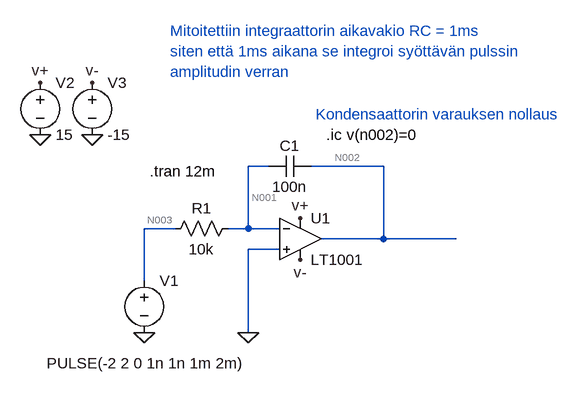
[diagram p0: schematic integraattori.asc]
integraattori.asc, the LTspice schematic file:
Version 4
SHEET 1 880 680
WIRE 336 -16 304 -16
WIRE 512 -16 400 -16
WIRE 192 80 144 80
WIRE 304 80 304 -16
WIRE 304 80 272 80
WIRE 352 80 304 80
WIRE 512 96 512 -16
WIRE 512 96 416 96
WIRE 624 96 512 96
WIRE 352 112 304 112
WIRE 144 160 144 80
WIRE 304 240 304 112
FLAG -16 -64 0
FLAG 64 -64 0
FLAG 144 240 0
FLAG 304 240 0
FLAG 384 64 v+
FLAG -16 -144 v+
FLAG 64 -144 v-
FLAG 384 128 v-
SYMBOL voltage 144 144 R0
WINDOW 3 -150 143 Left 2
WINDOW 123 0 0 Left 2
WINDOW 39 0 0 Left 2
SYMATTR InstName V1
SYMATTR Value PULSE(-2 2 0 1n 1n 1m 2m)
SYMBOL voltage -16 -160 R0
WINDOW 123 0 0 Left 2
WINDOW 39 0 0 Left 2
SYMATTR InstName V2
SYMATTR Value 15
SYMBOL voltage 64 -160 R0
WINDOW 123 0 0 Left 2
WINDOW 39 0 0 Left 2
SYMATTR InstName V3
SYMATTR Value -15
SYMBOL Opamps\\LT1001 384 32 R0
SYMATTR InstName U1
SYMBOL cap 400 -32 R90
WINDOW 0 0 32 VBottom 2
WINDOW 3 32 32 VTop 2
SYMATTR InstName C1
SYMATTR Value 100n
SYMBOL res 288 64 R90
WINDOW 0 0 56 VBottom 2
WINDOW 3 32 56 VTop 2
SYMATTR InstName R1
SYMATTR Value 10k
TEXT 152 -8 Left 2 !.tran 12m
TEXT 424 -64 Left 2 !.ic v(n002)=0
TEXT 184 -224 Left 2 ;Mitoitettiin integraattorin aikavakio RC = 1ms\nsiten että 1ms aikana se integroi syöttävän pulssin\namplitudin verran
TEXT 408 -96 Left 2 ;Kondensaattorin varauksen nollaus

The netlist it stands for:
* integraattori.asc
V1 N003 0 PULSE(-2 2 0 1n 1n 1m 2m)
V2 v+ 0 15
V3 v- 0 -15
XU1 0 N001 v+ v- N002 LT1001  ; pins In+ In- V+ V- OUT
C1 N002 N001 100n
R1 N001 N003 10k
.tran 12m
.ic v(n002)=0
* Mitoitettiin integraattorin aikavakio RC = 1ms
* siten että 1ms aikana se integroi syöttävän pulssin
* amplitudin verran
* Kondensaattorin varauksen nollaus
.lib LTC.lib
.backanno
.end

* Results of the author's LTspice run, read from the files saved beside the schematic
* Operating Point, zero values left out:
*   V(n003) = -2 V
*   V(v+) = 15 V
*   V(v-) = -15 V
*   V(n001) = -1.378 V
*   I(R1) = 62.19 µA
*   I(V3) = 1.65 nA
*   I(V2) = -38.44 mA
*   I(V1) = 62.19 µA
*   Ix(u1:1) = 62.19 µA
*   Ix(u1:2) = -62.19 µA
*   Ix(u1:3) = 38.44 mA
*   Ix(u1:4) = -1.635 nA
*   Ix(u1:5) = -38.45 mA
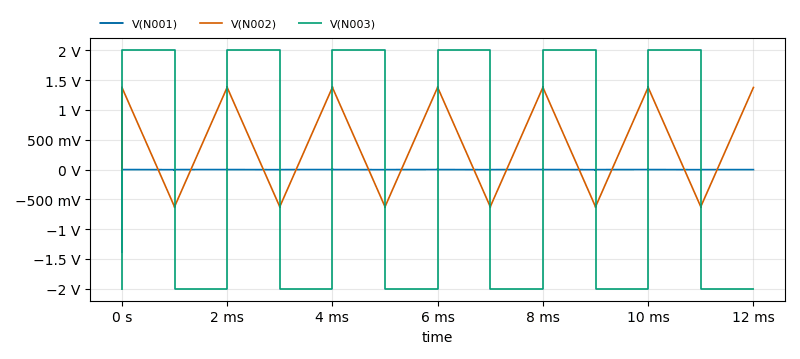
[diagram p1: Transient Analysis of integraattori.asc, plotted from the saved traces]
* Transient Analysis, 1 run:
*   V(N001): min -1.378 V, max 12.96 mV, average -34.46 µV, rms 3.216 mV, last -375.1 µV
*   V(N002): min -634.8 mV, max 1.391 V, average 377.9 mV, rms 1.017 V, last 1.377 V
*   V(N003): min -2 V, max 2 V, average 2 µV, rms 2 V, last -2 V